# Altium project PCB_Project1.PrjPCB
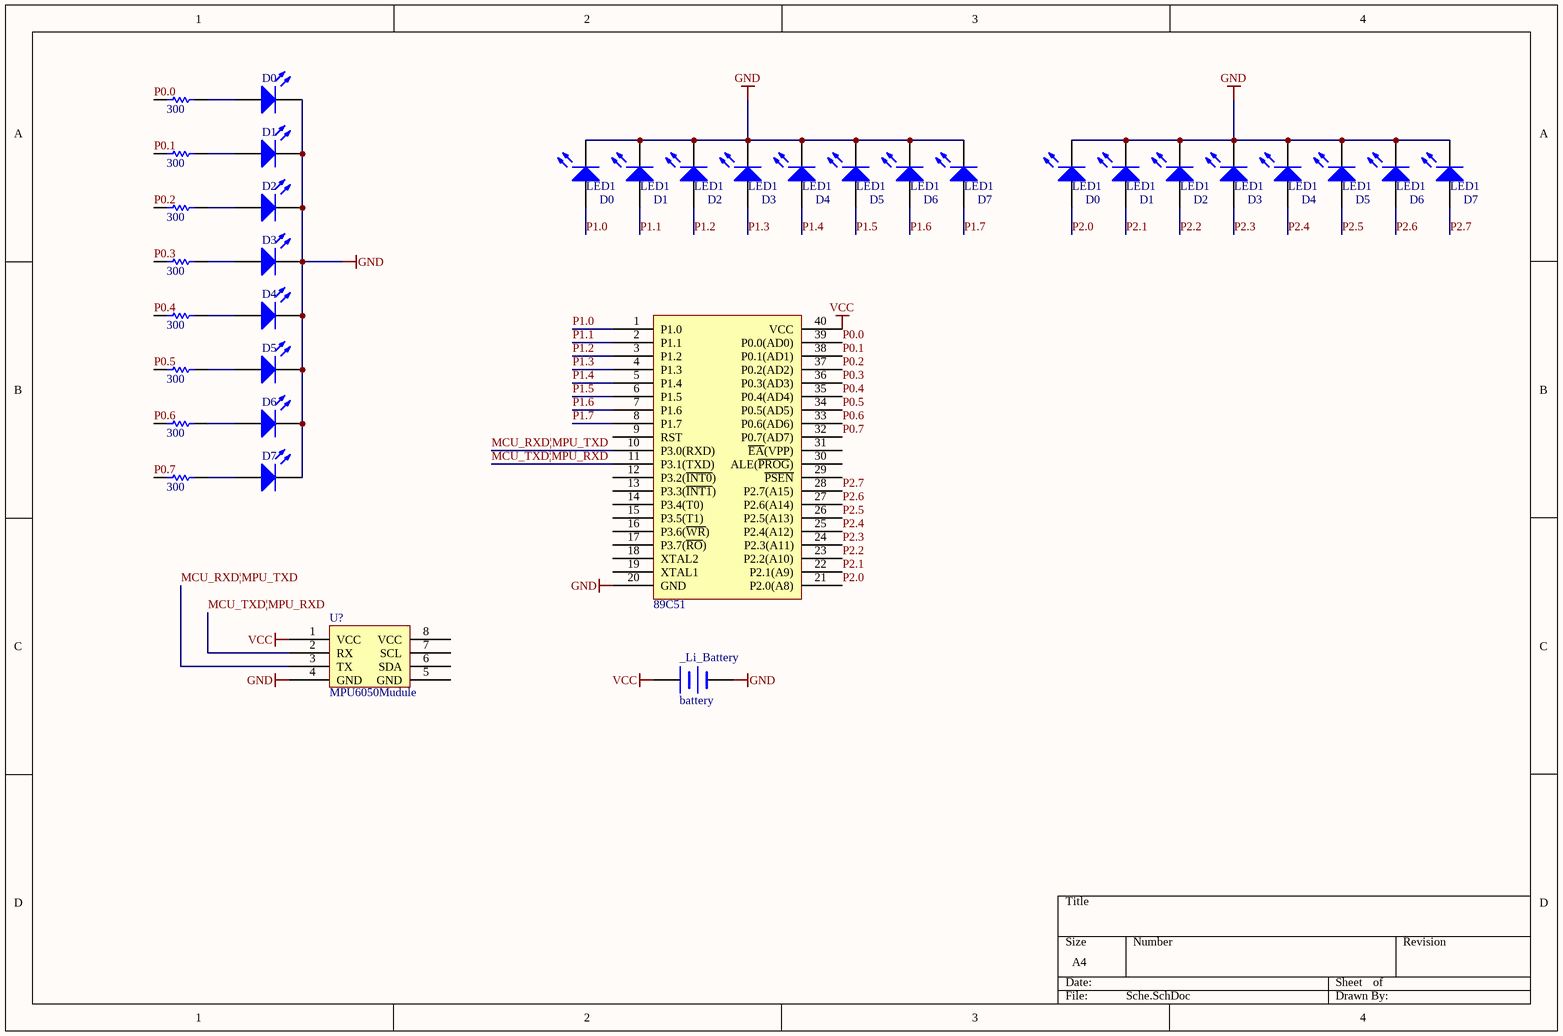
[diagram p0: Sche.SchDoc]
1 sheet, 35 parts. Net scope: global (net labels, ports and power ports of the same name join across sheets).
Board file: PCB1.PcbDoc

## Sheet Sche.SchDoc
size A4

### Parts
(Parts that share a designator on the sheet are numbered #1, #2 ... from top to bottom, then left to right.)
?#1  300  [AXIAL-0.3]
?#2  300  [AXIAL-0.3]
?#3  300  [AXIAL-0.3]
?#4  300  [AXIAL-0.3]
?#5  300  [AXIAL-0.3]
?#6  89C51
?#7  300  [AXIAL-0.3]
?#8  300  [AXIAL-0.3]
?#9  300  [AXIAL-0.3]
_Li_Battery  battery
D0#1  (no value)  [LED-0]
D0#2  LED1  [LED-0]
D0#3  LED1  [LED-0]
D1#1  (no value)  [LED-0]
D1#2  LED1  [LED-0]
D1#3  LED1  [LED-0]
D2#1  LED1  [LED-0]
D2#2  LED1  [LED-0]
D2#3  (no value)  [LED-0]
D3#1  LED1  [LED-0]
D3#2  LED1  [LED-0]
D3#3  (no value)  [LED-0]
D4#1  LED1  [LED-0]
D4#2  LED1  [LED-0]
D4#3  (no value)  [LED-0]
D5#1  LED1  [LED-0]
D5#2  LED1  [LED-0]
D5#3  (no value)  [LED-0]
D6#1  LED1  [LED-0]
D6#2  LED1  [LED-0]
D6#3  (no value)  [LED-0]
D7#1  LED1  [LED-0]
D7#2  LED1  [LED-0]
D7#3  (no value)  [LED-0]
U?  MPU6050Mudule  [MPU6050Module]

### Nets
GND: ?#6.20(GND) _Li_Battery.2(-) D0#1.2(K) D0#2.2(K) D0#3.2(K) D1#1.2(K) D1#2.2(K) D1#3.2(K) D2#1.2(K) D2#2.2(K) D2#3.2(K) D3#1.2(K) D3#2.2(K) D3#3.2(K) D4#1.2(K) D4#2.2(K) D4#3.2(K) D5#1.2(K) D5#2.2(K) D5#3.2(K) D6#1.2(K) D6#2.2(K) D6#3.2(K) D7#1.2(K) D7#2.2(K) D7#3.2(K) U?.4(GND)
VCC: ?#6.40(VCC) _Li_Battery.1(+) U?.1(VCC)
MCU_RXD|MPU_TXD: ?#6.10(P3.0(RXD)) U?.3(TX)
MCU_TXD|MPU_RXD: ?#6.11(P3.1(TXD)) U?.2(RX)
P0.0: ?#1.1 ?#6.39(P0.0(AD0))
P0.1: ?#2.1 ?#6.38(P0.1(AD1))
P0.2: ?#3.1 ?#6.37(P0.2(AD2))
P0.3: ?#4.1 ?#6.36(P0.3(AD3))
P0.4: ?#5.1 ?#6.35(P0.4(AD4))
P0.5: ?#6.34(P0.5(AD5)) ?#7.1
P0.6: ?#6.33(P0.6(AD6)) ?#8.1
P0.7: ?#6.32(P0.7(AD7)) ?#9.1
P1.0: ?#6.1(P1.0) D0#2.1(A)
P1.1: ?#6.2(P1.1) D1#2.1(A)
P1.2: ?#6.3(P1.2) D2#1.1(A)
P1.3: ?#6.4(P1.3) D3#1.1(A)
P1.4: ?#6.5(P1.4) D4#1.1(A)
P1.5: ?#6.6(P1.5) D5#1.1(A)
P1.6: ?#6.7(P1.6) D6#1.1(A)
P1.7: ?#6.8(P1.7) D7#1.1(A)
P2.0: ?#6.21(P2.0(A8)) D0#3.1(A)
P2.1: ?#6.22(P2.1(A9)) D1#3.1(A)
P2.2: ?#6.23(P2.2(A10)) D2#2.1(A)
P2.3: ?#6.24(P2.3(A11)) D3#2.1(A)
P2.4: ?#6.25(P2.4(A12)) D4#2.1(A)
P2.5: ?#6.26(P2.5(A13)) D5#2.1(A)
P2.6: ?#6.27(P2.6(A14)) D6#2.1(A)
P2.7: ?#6.28(P2.7(A15)) D7#2.1(A)
Net?#1_2: ?#1.2 D0#1.1(A)
Net?#2_2: ?#2.2 D1#1.1(A)
Net?#3_2: ?#3.2 D2#3.1(A)
Net?#4_2: ?#4.2 D3#3.1(A)
Net?#5_2: ?#5.2 D4#3.1(A)
Net?#7_2: ?#7.2 D5#3.1(A)
Net?#8_2: ?#8.2 D6#3.1(A)
Net?#9_2: ?#9.2 D7#3.1(A)

Not connected (* = marked no-connect by the designer): ?#6 9(RST) 12(P3.2(~{INT0})) 13(P3.3(~{INT1})) 14(P3.4(T0)) 15(P3.5(T1)) 16(P3.6(~{WR})) 17(P3.7(~{RO})) 18(XTAL2) 19(XTAL1) 29(~{PSEN}) 30(ALE(~{PROG})) 31(~{EA}(VPP)); U? 5(GND) 6(SDA) 7(SCL) 8(VCC)

### Library data of the parts
?#1-?#5 ?#7-?#9 = Res1: Resistor; Published: 8-Jun-2000; LatestRevisionDate: 17-Jul-2002; LatestRevisionNote: Re-released for DXP Platform.; PackageReference: AXIAL-0.3; Publisher: Altium Limited; PackageDescription: Axial Device, Thru-Hole; 2 Leads; 0.3 in Pin Spacing
D0#1-D0#3 D1#1-D1#3 D2#1-D2#3 D3#1-D3#3 D4#1-D4#3 D5#1-D5#3 D6#1-D6#3 D7#1-D7#3 = LED0: Typical INFRARED GaAs LED; Published: 8-Jun-2000; LatestRevisionDate: 08-Jul-2005; LatestRevisionNote: Mech Layer 1 removed.; PackageReference: LED-0; Publisher: Altium Limited; PackageDescription: LED; 2 Leads
U? = MPU6050Mudule: 君悦智控高精度6轴传感器